# Altium schematic sheet ZPZH.SchDoc
size OrCAD A; Organization: Altium Limited; Address1: L3, 12a Rodborough Rd; Address2: Frenchs Forest; Address3: NSW; Address4: Australia 2086
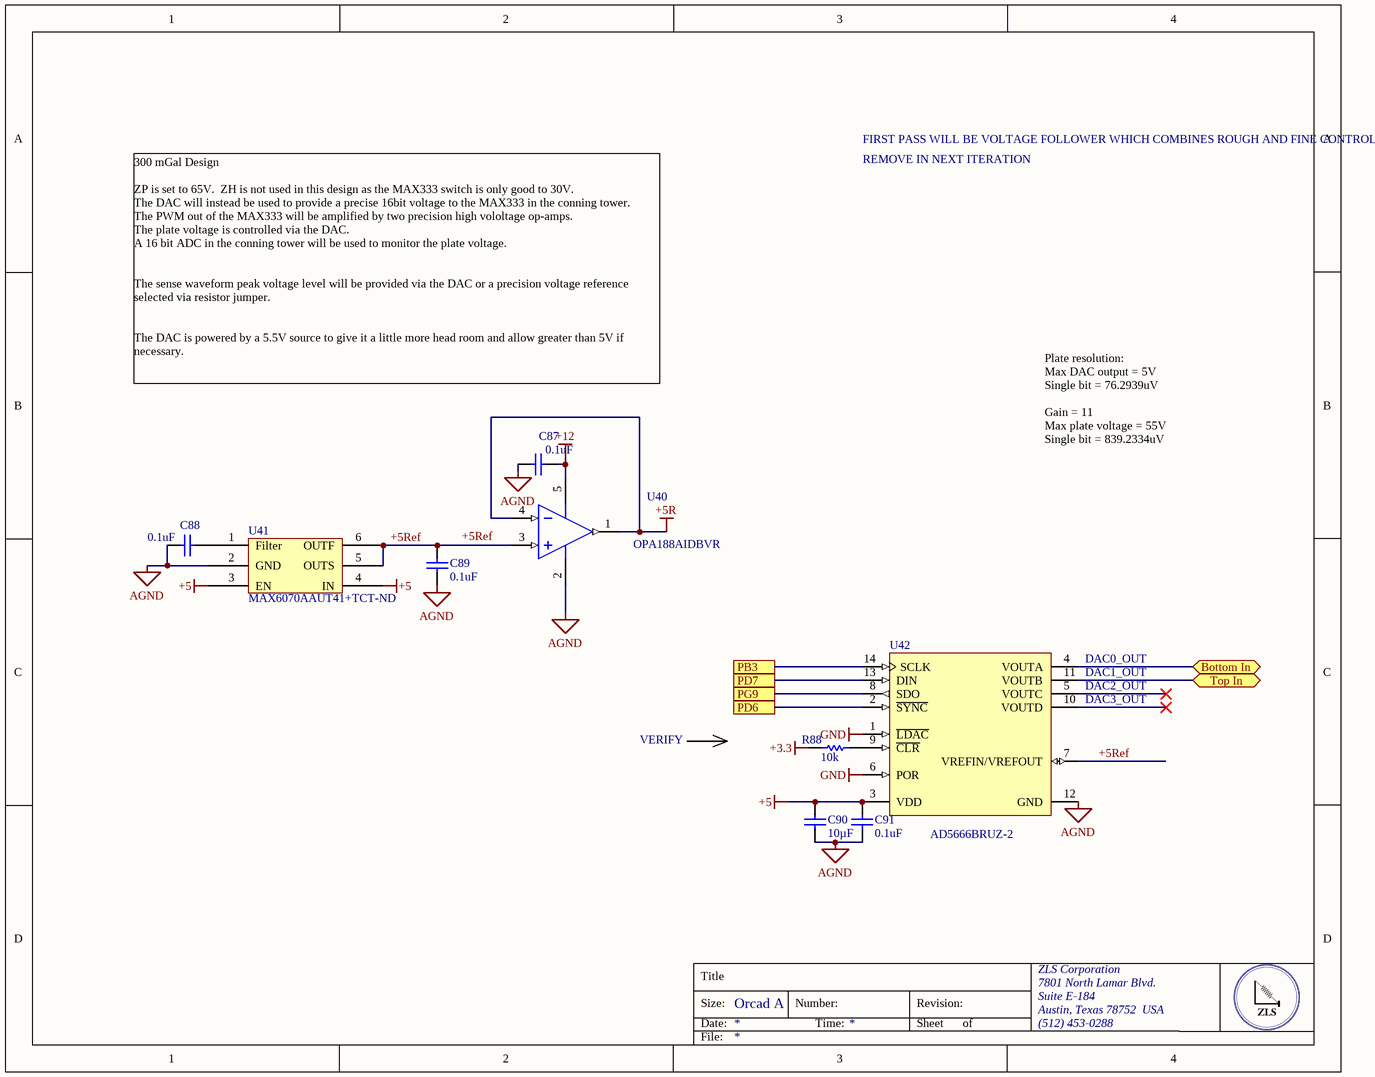
[diagram p0: ZPZH.SchDoc]

## Parts
C87  0.1uF  [CAPC0402(1005)60_L]
C88  0.1uF  [CAPC0402(1005)60_L]
C89  0.1uF  [CAPC0402(1005)60_L]
C90  Capacitance: 10µF  [CAPC0805(2012)145_N]  (hidden comment: 10uF)
C91  0.1uF  [CAPC0402(1005)60_L]
R88  10k  [RESC0402(1005)_M]
U40  OPA188AIDBVR  [DBV0005A_M]
U41  Supplier Part Number 1: MAX6070AAUT41+TCT-ND  [SOT95P280X445-6N]  (hidden comment: MAX6070AAUT41+T)
U42  AD5666BRUZ-2  [RU-14_N]

## Ports
Bottom In (bidir), PB3, PD6, PD7, PG9, Top In (bidir)

## Nets
+3.3: R88.1
+5: C90.2 C91.1 U41.3(EN) U41.4(IN) U42.3(VDD)
+5R: U40.1(OUT) U40.4(IN-)
+12: C87.1 U40.5(V+)
AGND: C87.2 C88.2 C89.1 C90.1 C91.2 U40.2(V-) U41.2(GND) U42.12(GND)
GND: U42.1(~{LDAC}) U42.6(POR)
+5Ref: C89.2 U40.3(IN+) U41.5(OUTS) U41.6(OUTF) U42.7(VREFIN/VREFOUT)
Bottom In: U42.4(VOUTA) ; port Bottom In
PB3: U42.14(SCLK) ; port PB3
PD6: U42.2(~{SYNC}) ; port PD6
PD7: U42.13(DIN) ; port PD7
PG9: U42.8(SDO) ; port PG9
Top In: U42.11(VOUTB) ; port Top In
NetC88_1: C88.1 U41.1(Filter)
NetR88_2: R88.2 U42.9(~{CLR})

Not connected (* = marked no-connect by the designer): U42 5(VOUTC)* 10(VOUTD)*

## Notes on the sheet
- FIRST PASS WILL BE VOLTAGE FOLLOWER WHICH COMBINES ROUGH AND FINE CONTROL
- REMOVE IN NEXT ITERATION
- 300 mGal Design
  ZP is set to 65V.  ZH is not used in this design as the MAX333 switch is only good to 30V.
  The DAC will instead be used to provide a precise 16bit voltage to the MAX333 in the conning tower.
  The PWM out of the MAX333 will be amplified by two precision high vololtage op-amps.
  The plate voltage is controlled via the DAC.
  A 16 bit ADC in the conning tower will be used to monitor the plate voltage.
  The sense waveform peak voltage level will be provided via the DAC or a precision voltage reference selected via resistor jumper.
  The DAC is powered by a 5.5V source to give it a little more head room and allow greater than 5V if necessary.
- Plate resolution:
  Max DAC output = 5V
  Single bit = 76.2939uV
  Gain = 11
  Max plate voltage = 55V
  Single bit = 839.2334uV
- (near U42) DAC0_OUT
- (near U42) DAC1_OUT
- (near U42) DAC2_OUT
- VERIFY
- (near U42) DAC3_OUT
- Labels drawn without touching a wire or pin: +5Ref
- Title
- Size:
- Date:
- Orcad A
- Number:
- Time:
- Revision:
- Sheet
- of
- ZLS Corporation
- 7801 North Lamar Blvd.
- Suite E-184
- Austin, Texas 78752  USA
- (512) 453-0288
- File:

## Library data of the parts
C87-C89 C91 = CMP-1034-00252-1: CAP CER 0.1UF 10V X7R 0402; Manufacturer: Murata Electronics North America; Manufacturer Part Number: GRM155R71A104KA01D; Tolerance: ±10%; Supplier 1: Digi-Key; Supplier Part Number 1: 490-6321-1-ND; RoHS: RoHS Compliant; Category: Capacitors; Stock 1: 2920395; Pricing 1: 1=0.1, 10=0.014, 100=0.0063, 500=0.00446, 1000=0.00351, 2500=0.00319, 5000=0.00293 (USD); Packaging: Cut Tape (CT); Part Status: Active; Voltage - Rated: 10V; Temperature Coefficient: X7R; Operating Temperature: -55°C ~ 125°C; Features: -; Ratings: -; Applications: General Purpose; Mounting Type: Surface Mount, MLCC; Package / Case: 0402 (1005 Metric); Size / Dimension: 0.039" L x 0.020" W (1.00mm x 0.50mm); Height - Seated (Max): -; Thickness (Max): 0.022" (0.55mm); Lead Spacing: -; ComponentLink1URL: http://www.murata.com/~/media/webrenewal/support/library/catalog/products/capacitor/mlcc/c02e.ashx?la=en-us; ComponentLink1Description: http://www.murata.com/~/media/webrenewal/support/library/catalog/products/capacitor/mlcc/c02e.ashx?la=en-us
C90 = CMP-1036-04795-1: CAP CER 10UF 25V X7R 0805; Manufacturer: Murata Electronics North America; Manufacturer Part Number: GRM21BR71E104KA01L; Tolerance: ±10%; Supplier 1: Digi-Key; Supplier Part Number 1: 490-1673-6-ND; RoHS: RoHS Compliant; Category: Capacitors; Stock 1: 891652; Pricing 1: 1=0.2, 10=0.145, 100=0.0683, 500=0.04788, 1000=0.03964 (USD); Packaging: Digi-Reel®; Part Status: Active; Voltage - Rated: 25V; Temperature Coefficient: X7R; Operating Temperature: -55°C ~ 125°C; Features: -; Ratings: -; Applications: General Purpose; Mounting Type: Surface Mount, MLCC; Package / Case: 0805 (2012 Metric); Size / Dimension: 0.079" L x 0.049" W (2.00mm x 1.25mm); Height - Seated (Max): -; Thickness (Max): 0.053" (1.35mm); Lead Spacing: -; Lead Style: -; ComponentLink1URL: http://www.murata.com/~/media/webrenewal/support/library/catalog/products/capacitor/mlcc/c02e.ashx; ComponentLink1Description: http://www.murata.com/~/media/webrenewal/support/library/catalog/products/capacitor/mlcc/c02e.ashx
R88 = CMP-1011-00940-1: 10k 0.063W 1% 0402 (1005 Metric)  SMD; Manufacturer: Panasonic; Manufacturer Part Number: ERJ-2RKF1002X; Resistance: 10kR; Temperature Coefficient: 100ppm/°C; Power Rating: 100mW; Voltage Rating: 50V; Supplier 1: Digi-Key; Supplier Part Number 1: P10.0KLDKR-ND; Stock 1: 12501303; Pricing 1: 1=0.10000, 10=0.04500, 100=0.01830, 1000=0.00823, 2500=0.00715, 5000=0.00590 (USD); RoHS: Yes; Mount: Surface Mount; Case/Package: 0402; Number of Pins: 2; Case Code (Metric): 1005; Case Code (Imperial): 0402; Contact Plating: Tin; Min Operating Temperature: -55°C; Max Operating Temperature: 155°C; Tolerance: 1%; Packaging: Tape and Reel; Composition: Thick Film; Termination: SMD/SMT; Voltage Rating (DC): 50V; Package Quantity: 1; Number of Terminations: 2; Max Power Dissipation: 100mW; Military Standard: Not; Features: Automotive AEC-Q200; Length: 1mm; Height: 0.35mm; Width: 0.02inch; Depth: 0.5mm; Radiation Hardening: No; Lead Free: Lead Free; REACH SVHC: No SVHC; ComponentLink1URL: https://datasheet.ciiva.com/11821/0900766b80f80784-11821171.pdf?src-supplier=RSComponents; ComponentLink1Description: https://datasheet.ciiva.com/11821/0900766b80f80784-11821171.pdf?src-supplier=RSComponents; ComponentLink2URL: https://datasheet.ciiva.com/16199/aoa0000ce2-16199478.pdf?src-supplier=Future+Electronics; ComponentLink2Description: https://datasheet.ciiva.com/16199/aoa0000ce2-16199478.pdf?src-supplier=Future+Electronics; ComponentLink3URL: https://datasheet.ciiva.com/17212/aoa0000ce2-17212102.pdf?src-supplier=Avnet+Europe; ComponentLink3Description: https://datasheet.ciiva.com/17212/aoa0000ce2-17212102.pdf?src-supplier=Avnet+Europe; ComponentLink4URL: https://datasheet.ciiva.com/24023/aoa0000ce2-24023017.pdf?src-supplier=Mouser; ComponentLink4Description: https://datasheet.ciiva.com/24023/aoa0000ce2-24023017.pdf?src-supplier=Mouser; ComponentLink5URL: https://datasheet.ciiva.com/28514/1678782-28514185.pdf?src-supplier=Element14; ComponentLink5Description: https://datasheet.ciiva.com/28514/1678782-28514185.pdf?src-supplier=Element14; ComponentLink6URL: https://datasheet.ciiva.com/43467/1678782-43467402.pdf?src-supplier=Farnell; ComponentLink6Description: https://datasheet.ciiva.com/43467/1678782-43467402.pdf?src-supplier=Farnell; ComponentLink7URL: https://datasheet.ciiva.com/27055/1987020-27055643.pdf?src-supplier=Jameco; ComponentLink7Description: https://datasheet.ciiva.com/27055/1987020-27055643.pdf?src-supplier=Jameco; ComponentLink8URL: https://datasheet.ciiva.com/48531/aoa0000ce2-48531069.pdf?src-supplier=Avnet; ComponentLink8Description: https://datasheet.ciiva.com/48531/aoa0000ce2-48531069.pdf?src-supplier=Avnet; ComponentLink9URL: https://datasheet.ciiva.com/9194/aoa0000ce2-9194142.pdf?src-supplier=Avnet; ComponentLink9Description: https://datasheet.ciiva.com/9194/aoa0000ce2-9194142.pdf?src-supplier=Avnet; ComponentLink10URL: https://datasheet.ciiva.com/16782/70260748-16782590.pdf?src-supplier=Allied+Electronics; ComponentLink10Description: https://datasheet.ciiva.com/16782/70260748-16782590.pdf?src-supplier=Allied+Electronics; ComponentLink11URL: https://datasheet.ciiva.com/16786/70260748-16786734.pdf?src-supplier=Allied+Electronics; ComponentLink11Description: https://datasheet.ciiva.com/16786/70260748-16786734.pdf?src-supplier=Allied+Electronics; ComponentLink12URL: https://datasheet.ciiva.com/30201/aoa0000ce2-30201022.pdf?src-supplier=Onlinecomponents.com; ComponentLink12Description: https://datasheet.ciiva.com/30201/aoa0000ce2-30201022.pdf?src-supplier=Onlinecomponents.com
U40 = CMP-0809-00005-2: Precision, Low Noise, Rail-to-Rail Output, Zero-Drift Operational Amplifier, 4 to 36 V, -40 to 125 degC, 5-pin SOT23 (DBV5), Green (RoHS & no Sb/Br); Manufacturer: Texas Instruments; Total Supply Voltage(Min)(+5V is 5, +/-5V is 10): 4; Offset Drift(Typ)(uV/C): 0.03; Rating: Catalog; SubFamily: Zero Drift Precision Amplifier; GBW(Typ)(MHz): 2; Slew Rate(Typ)(V/us): 0.8; Number of Channels: 1; CMRR(Min)(dB): 120; Iq per channel(Max)(mA): 0.51; Total Supply Voltage(Max)(+5V is 5, +/-5V is 10): 36; Unity Gain Bandwidth Product: 2MHz; Max Supply Voltage: 36V; Min Supply Voltage: 4V; Min Dual Supply Voltage: 2V; Max Dual Supply Voltage: 18V; Nominal Supply Current: 510uA; Common Mode Rejection Ratio: 120dB; Slew Rate: 0.8V/µs; Input Bias Current: 160pA; Input Offset Voltage (Vos): 6uV; Operating Supply Current: 450uA; Output Current per Channel: 18mA; Voltage Gain: 136dB; Input Voltage Noise Density: 8.8nV/sqrt Hz; Power Supply Rejection Ratio (PSRR): 142dB; PartNumber: OPA188AIDBVR; ComponentLink2Description: Datasheet; ComponentLink2URL: http://www.ti.com/lit/ds/symlink/opa188.pdf; ComponentLink1Description: Manufacturer URL; Mounting Technology: Surface Mount; Eco-Plan: Green (RoHS & no Sb/Br); ComponentLink1URL: http://www.ti.com/; PackageVersion: 4073253-4/K, 03/2006; DatasheetVersion: SBOS642A; ComponentLink3Description: Package Specification; PackageReference: DBV0005A; ComponentLink3URL: http://www.ti.com/litv/pdf/mpds018i; PackageDescription: 5-Pin Plastic Small Outline, Body 1.6 x 2.9 mm, Pitch 0.95 mm; Code_JEDEC: MO-178; Supplier 1: Arrow; Supplier Part Number 1: OPA188AIDBVR; Manufacturer Part Number: OPA188AIDBVR; Stock 1: 838; Pricing 1: 1=2.2115, 10=1.9133, 25=1.722, 100=1.5598, 250=1.5572, 500=1.3341 (USD); Case/Package: SOT-23-5; Number of Pins: 5; Contact Plating: Gold; Min Operating Temperature: -40°C; Max Operating Temperature: 125°C; Packaging: Tape and Reel; Package Quantity: 3000; Nominal Gain Bandwidth Product: 2MHz; Number of Circuits: 1; Gain Bandwidth Product: 2MHz; Number of Elements: 1; Lead Free: Lead Free; ComponentLink4URL: http://www.ti.com/lit/gpn/opa188?src-supplier=Mouser; ComponentLink4Description: http://www.ti.com/lit/gpn/opa188?src-supplier=Mouser; ComponentLink5URL: http://www.ti.com/lit/ds/symlink/opa188.pdf?src-supplier=Digi-Key; ComponentLink5Description: http://www.ti.com/lit/ds/symlink/opa188.pdf?src-supplier=Digi-Key
U41 = MAX6070AAUT41+T: IC VREF SERIES 4.096V SOT23; Manufacturer: Maxim Integrated; Output Type: Fixed; Tolerance: ±0.04%; Temperature Coefficient: 6ppm/°C; Noise - 0.1Hz to 10Hz: 9.6µVp-p; Noise - 10Hz to 10kHz: 9µVrms; Voltage - Input: 4.3 V ~ 5.5 V; Current - Supply: 350µA; Supplier 1: Digi-Key; Manufacturer Part Number: MAX6070AAUT41+T; RoHS: RoHS Compliant; Category: Integrated Circuits (ICs); Stock 1: 2623; Pricing 1: 1=3.41, 10=3.213, 25=2.5704, 50=2.4418, 100=2.2491, 250=2.13344, 500=2.05634 (USD); Packaging: Cut Tape (CT); Part Status: Active; Reference Type: Series; Voltage - Output (Min/Fixed): 4.096V; Operating Temperature: -40°C ~ 125°C (TA); Mounting Type: Surface Mount; Package / Case: SOT-23-6; Supplier Device Package: SOT-23-6; ComponentLink1URL: https://datasheets.maximintegrated.com/en/ds/MAX6070-MAX6071.pdf; ComponentLink1Description: https://datasheets.maximintegrated.com/en/ds/MAX6070-MAX6071.pdf
U42 = CMP-0318-01541-2: Quad 16-Bit Digital-to-Analog Converter with 5 ppm/degC On-Chip Reference, -40 to +105 degC, RU-14, Pb-Free, Tube; Generic Part Number: AD5666; Manufacturer: Analog Devices; Max V+: 5.5V; Op Pwr Diss: 12.5mW; Settling Time: 6Âµs; Resolution (Bits): 16; Single Supply: Yes; # DAC Outputs: 4; Resolution: 16b; Conversion Rate: 95KS/s; Integral Nonlinearity (INL): 16LSB; Output Type: Voltage; Interface: SPI,Serial; Min Supply Voltage: 2.7V; Slew Rate: 1.5V/µs; Differential Output: No; Power Dissipation: 8.8mW; Polarity: Unipolar; Min Input Voltage: 0uV; Nominal Supply Current: 1.3mA; Mounting Technology: Surface Mount; ComponentLink3URL: http://www.analog.com/static/imported-files/packages/36057385283879153717235186773RU14.pdf; ComponentLink2Description: Datasheet; Packing: Tube; PackageVersion: Aug-2002; ComponentLink4Description: Product URL; ComponentLink1Description: Manufacturer URL; PartNumber: AD5666BRUZ-2; PackageReference: RU-14; Code_JEDEC: MO-153-AB-1; ComponentLink2URL: http://www.analog.com/static/imported-files/data_sheets/AD5666.pdf; ComponentLink4URL: http://www.analog.com/en/digital-to-analog-converters/da-converters/ad5666/products/product.html; PackageDescription: 14-Lead Thin Shrink Small Outline Package [TSSOP]; DatasheetVersion: Rev.D; RoHS: Y; ComponentLink1URL: http://www.analog.com/en/index.html; ComponentLink3Description: Package Specification; RevisionNote: Component URL fixed; Supplier 1: Arrow; Supplier Part Number 1: AD5666BRUZ-2; Manufacturer Part Number: AD5666BRUZ-2; Stock 1: 85; Pricing 1: 1=18.32, 10=16.76, 25=15.54, 50=15.29, 100=13.33, 250=12.86, 500=12.13, 1000=12.09 (USD); Case/Package: SOP; Number of Pins: 14; Contact Plating: Tin,Matte; Min Operating Temperature: -40°C; Max Operating Temperature: 105°C; Package Quantity: 1; Number of Channels: 4; Max Supply Voltage: 5.5V; Number of DAC Channels: 4; Max Power Dissipation: 12.5mW; Packaging: Rail/Tube; Number of Bits: 16; Number of D/A Converters: 4; Number of Converters: 4; Sampling Rate: 95KS/s; Max Input Voltage: 5.5V; Max Output Voltage: 5.5V; Min Output Voltage: 0uV; Termination: SMD/SMT; Length: 5.1mm; Height: 1.05mm; Width: 4.5mm; Radiation Hardening: No; Lead Free: Contains Lead; REACH SVHC: No SVHC; ComponentLink5URL: http://www.analog.com/media/en/technical-documentation/data-sheets/AD5666.pdf?src-supplier=Digi-Key; ComponentLink5Description: http://www.analog.com/media/en/technical-documentation/data-sheets/AD5666.pdf?src-supplier=Digi-Key; ComponentLink6URL: http://www.analog.com/static/imported-files/data_sheets/AD5666.pdf?src-supplier=Avnet; ComponentLink6Description: http://www.analog.com/static/imported-files/data_sheets/AD5666.pdf?src-supplier=Avnet; ComponentLink7URL: http://www.analog.com/static/imported-files/data_sheets/AD5666.pdf?src-supplier=Avnet+Europe; ComponentLink7Description: http://www.analog.com/static/imported-files/data_sheets/AD5666.pdf?src-supplier=Avnet+Europe; ComponentLink8URL: http://www.farnell.com/datasheets/1610743.pdf?src-supplier=Element14; ComponentLink8Description: http://www.farnell.com/datasheets/1610743.pdf?src-supplier=Element14; ComponentLink9URL: http://datasheet.iiic.cc/analog_devices/AD5666BRUZ-2.pdf?src-supplier=IIIC; ComponentLink9Description: http://datasheet.iiic.cc/analog_devices/AD5666BRUZ-2.pdf?src-supplier=IIIC